# EAGLE board TSC_Project (EAGLE 9.7.0)
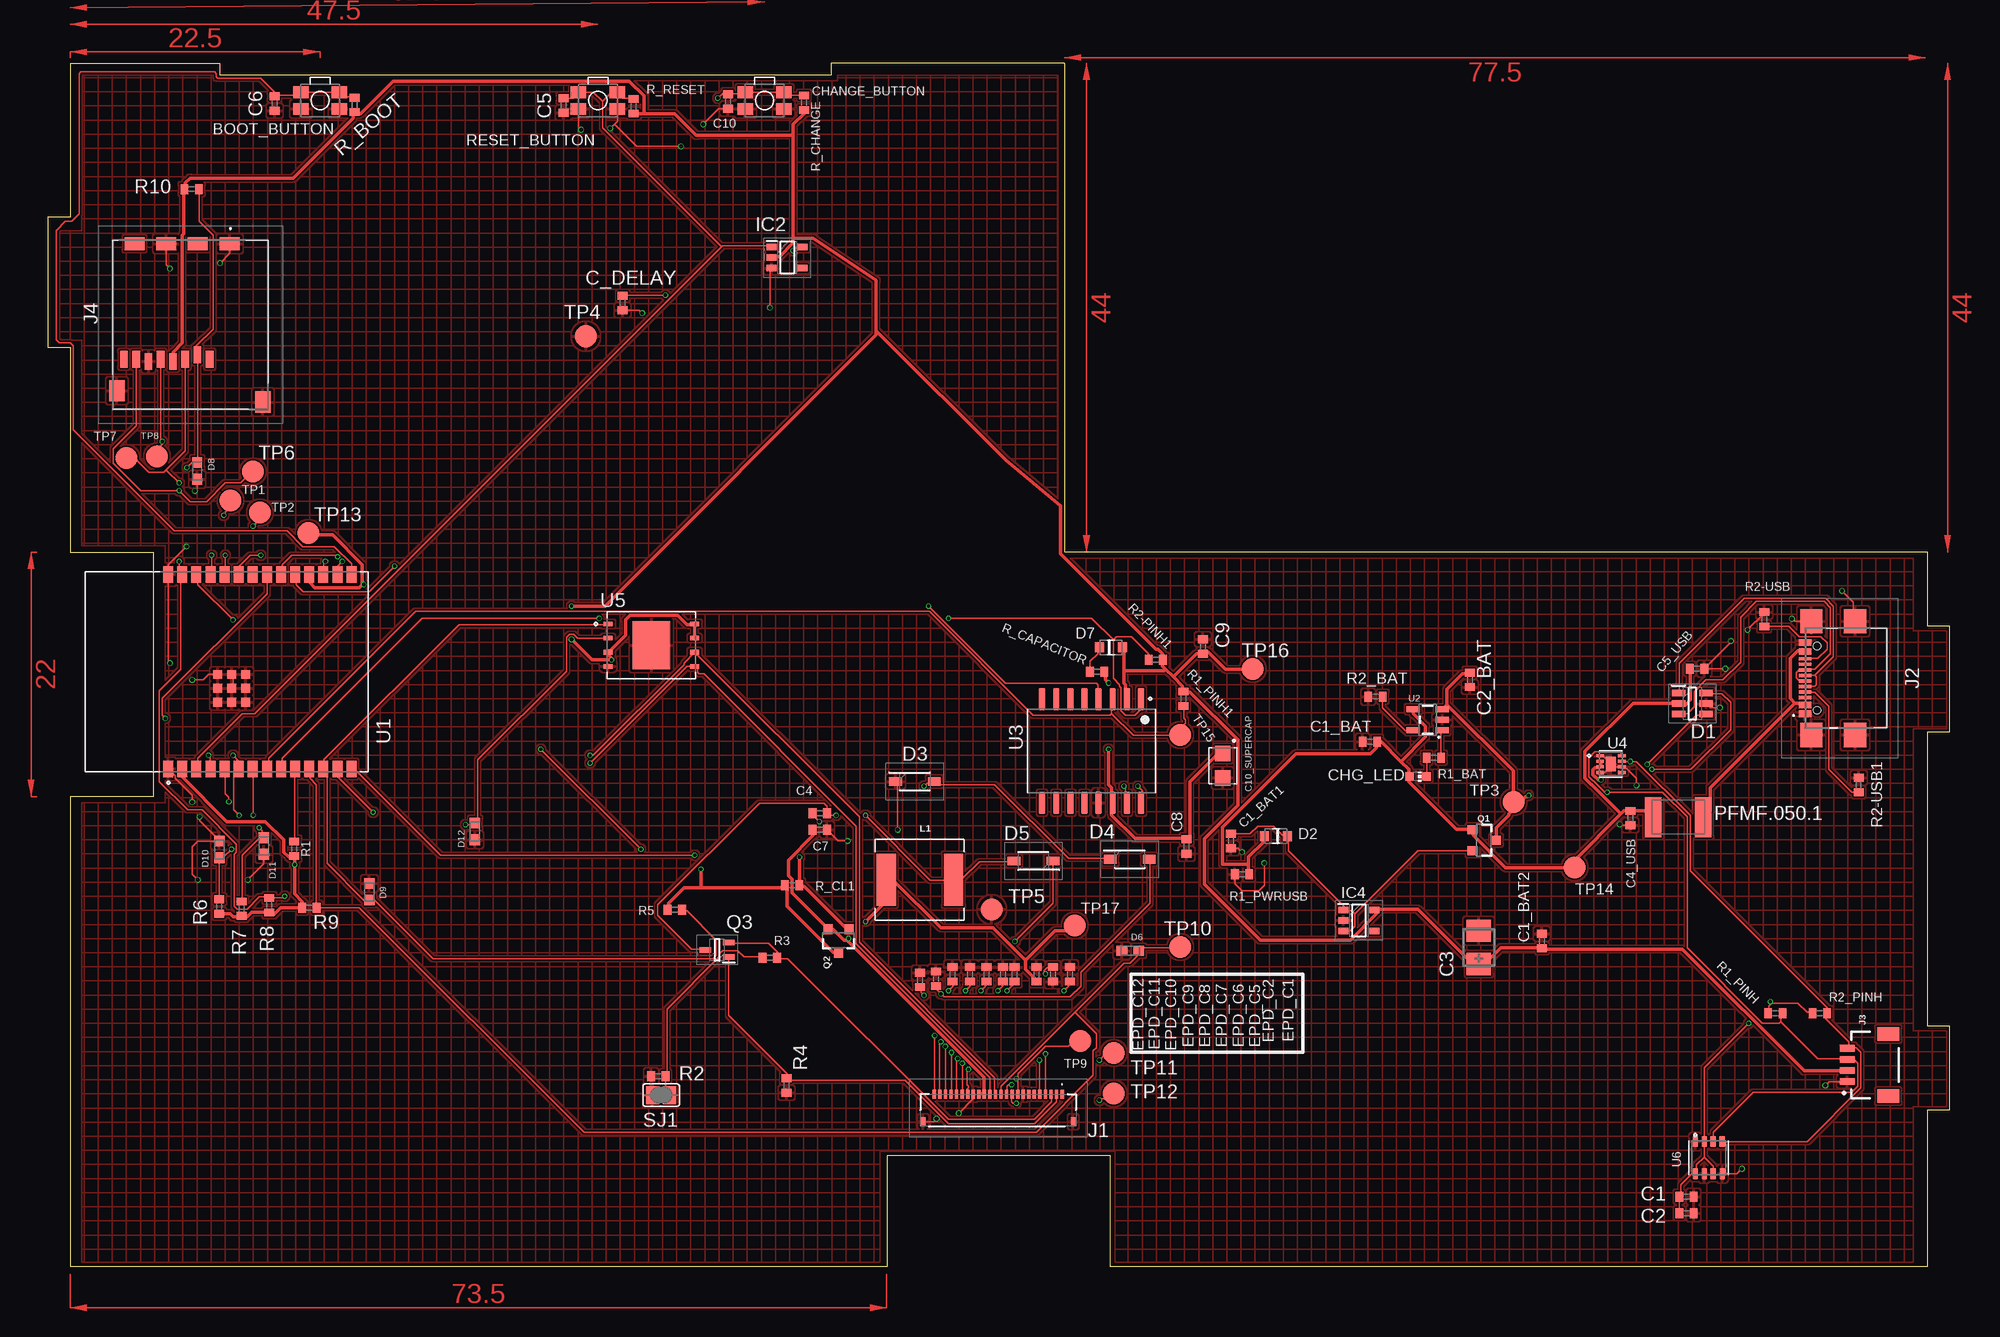
[diagram p1: board, top side]
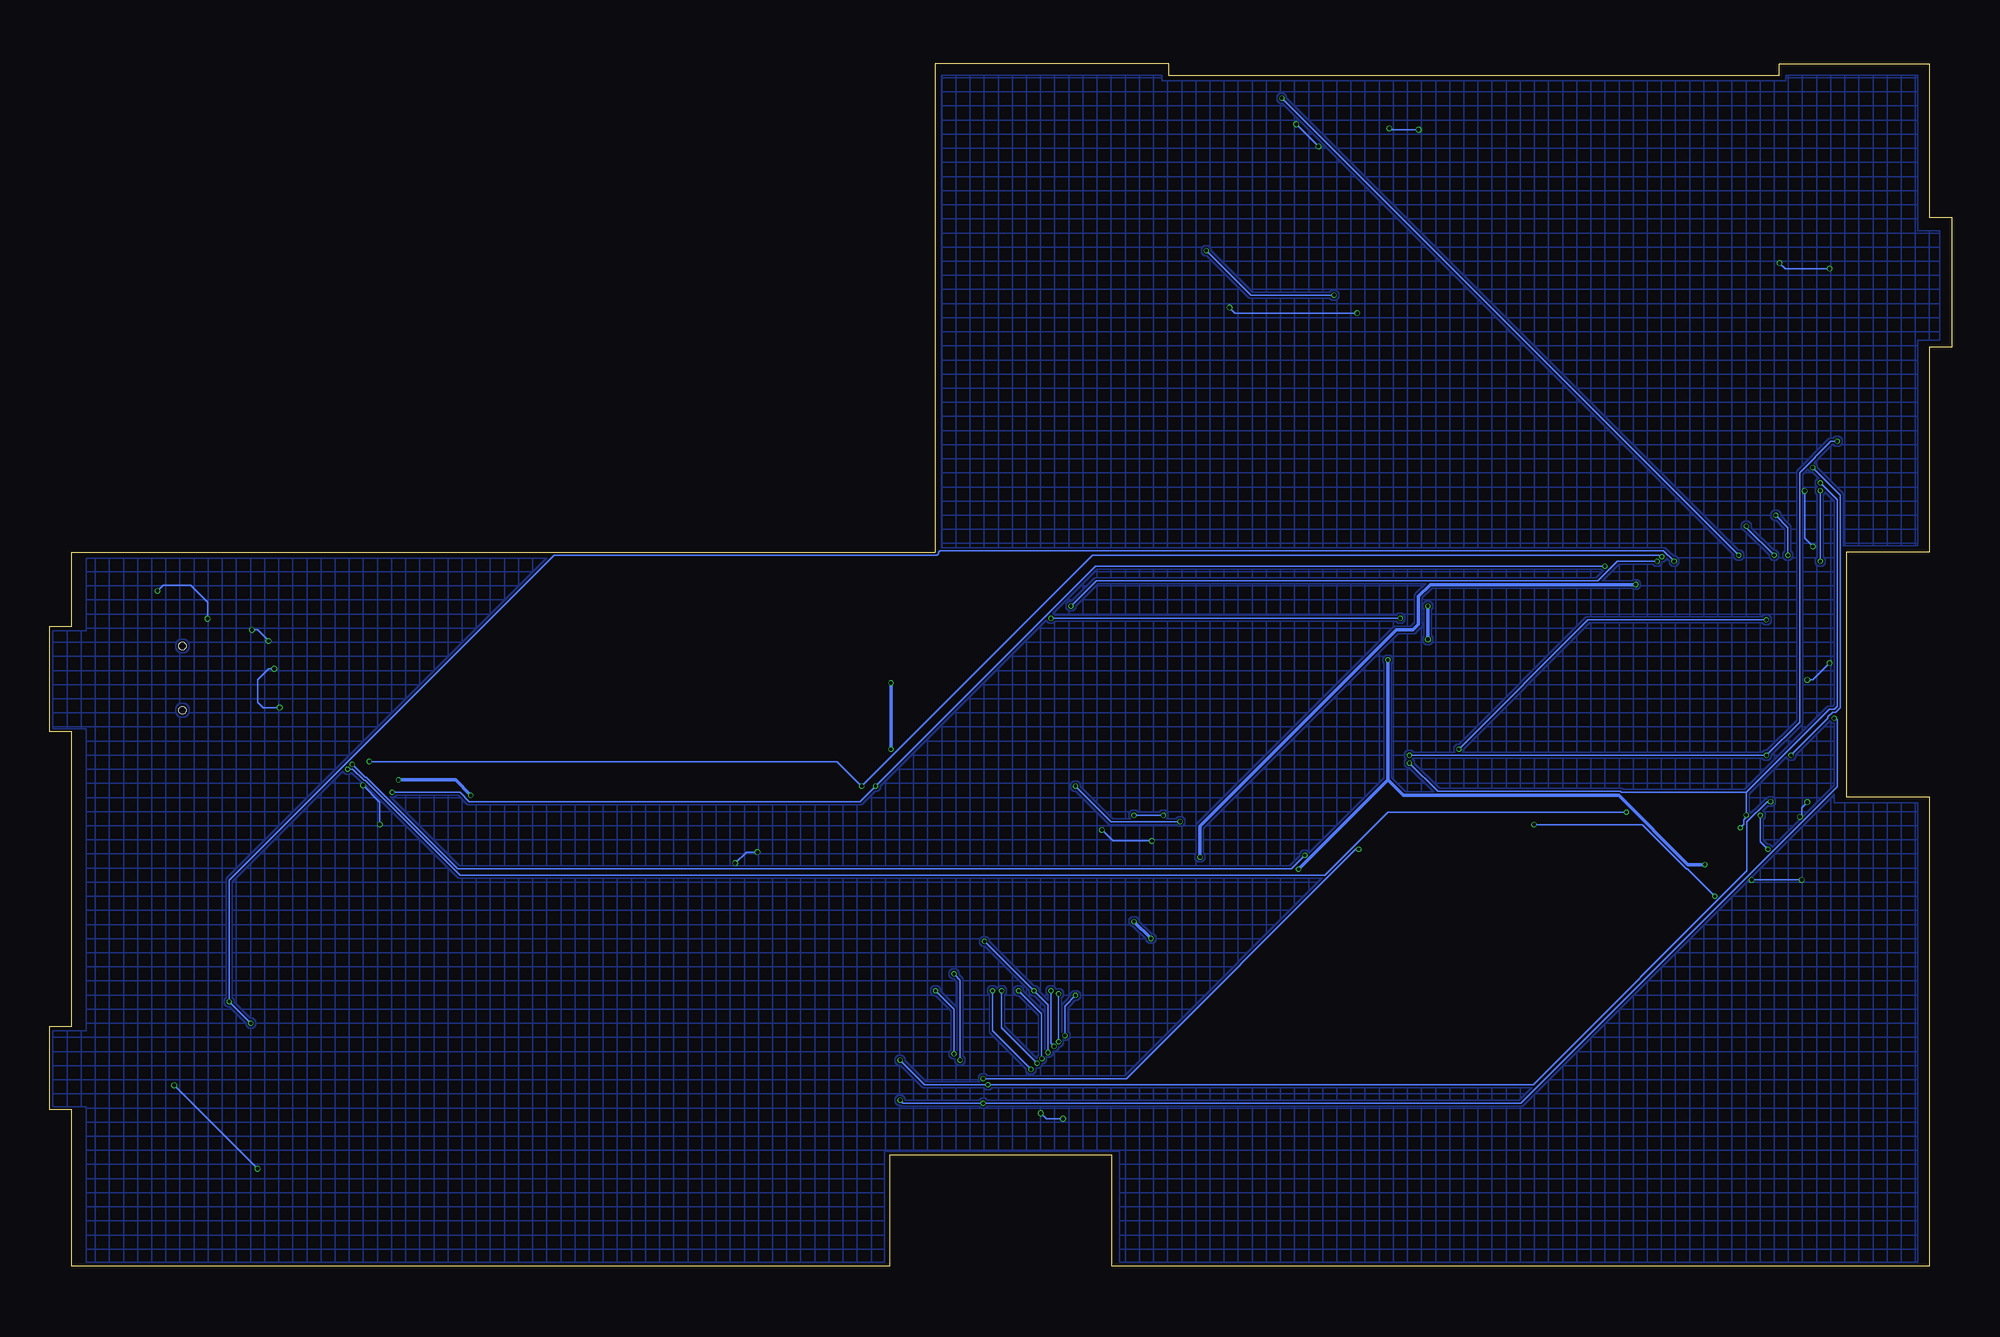
[diagram p2: board, bottom side, seen from below]

Size 171.2 x 108.28 mm. Coordinates in mm from the lower left corner, seen from the top.
Outline: 95.6,10 95.6,0 169.2,0 169.2,14.1 171.2,14.1 171.2,21.63 169.2,21.63 169.2,48.1 171.2,48.1 171.2,57.6 169.2,57.6 169.2,64.28 91.5,64.28 91.5,108.28 70.5,108.28 70.5,107.2 15.5,107.2 15.5,108.2 2,108.2 2,94.4 0,94.4 0,82.7 2,82.7 2,64.28 9.5,64.28 9.5,42.28 2,42.28 2,0 75.6,0 75.6,10 95.6,10
Copper layers (1*16): Top 0.035mm / dielectric 1.6mm / Bottom 0.035mm
Design rules "jlcpcb-2layers.dru": minimum track width 0.15mm, minimum drill 0.3mm, track to track 5mil, track to pad 5mil, pad to pad 5mil, via to via 5mil, smd to smd 5mil, copper to edge 0.2mm, drill to drill 6mil, minimum pad ring 10mil, minimum via ring 3mil, stop-mask expansion 4mil, vias tented up to drill 0mil, thermal gap 10mil

## Footprints (pad centres in the part's own frame; a part is rotated, then mirrored left to right if it is on the bottom)
MYBUTTON = smd 1.4 x 1.05: 1 1.75,0.75; 2 -1.75,0.75; 3 -1.75,-0.75; 4 1.75,-0.75
ESP32_WROVER_EAGLE-LTSPICE_C0402 = smd 0.7 x 0.9: 1 -0.65,0; 2 0.65,0
EAGLE-LTSPICE_C0402 = smd 0.7 x 0.9: 1 -0.65,0; 2 0.65,0
RCL_CT3528 = smd 2 x 2.2: + -1.5,0; - 1.5,0
CAPCP3225X100N = smd 1.4 x 1.4: 1 -1.1,0; 2 1.1,0
ADAFRUIT_CHIP-LED0603 = smd 0.8 x 0.8: A 0,-0.75; C 0,0.75
SOT95P280X145-6N = smd 1.2 x 0.6: 1 -1.25,0.95; 2 -1.25,0; 3 -1.25,-0.95; 4 1.25,-0.95; 5 1.25,0; 6 1.25,0.95
ESP32_WROVER_AVX---SD0805S020S1R0_AVX_SD0805S020S1R0_0 = smd 0.8 x 0.9: 1 -1.05,0; 2 1.05,0
SOD3716X135N = smd 1.15 x 0.8: 1 -1.75,0; 2 1.75,0
DIOC1608X36N = smd 0.97 x 0.94: 1 -0.75,0; 2 0.75,0
SOT95P280X125-5N = smd 0.9 x 0.6: 1 -1.4,0.95; 2 -1.4,0; 3 -1.4,-0.95; 4 1.4,-0.95; 5 1.4,0.95
SOT95P280X120-5N = smd 0.9 x 0.6: 1 -1.4,0.95; 2 -1.4,0; 3 -1.4,-0.95; 4 1.4,-0.95; 5 1.4,0.95
FH34SRJ24S05SH99 = smd 0.3 x 0.8: 1 5.75,1.45; 2 5.25,1.45; 3 4.75,1.45; 4 4.25,1.45; 5 3.75,1.45; 6 3.25,1.45; 7 2.75,1.45; 8 2.25,1.45; 9 1.75,1.45; 10 1.25,1.45; 11 0.75,1.45; 12 0.25,1.45; 13 -0.25,1.45; 14 -0.75,1.45; 15 -1.25,1.45; 16 -1.75,1.45; 17 -2.25,1.45; 18 -2.75,1.45; 19 -3.25,1.45; 20 -3.75,1.45; 21 -4.25,1.45; 22 -4.75,1.45; 23 -5.25,1.45; 24 -5.75,1.45 | smd 0.4 x 0.8: MP1 6.75,-1.05; MP2 -6.75,-1.05
SAMACSYS_PARTS_USB4110GFA = smd 0.3 x 1.15: A1 -3.35,3.678; A4 -2.55,3.678; A5 -1.25,3.678; A6 -0.25,3.678; A7 0.25,3.678; A8 1.25,3.678; A9 2.55,3.678; A12 3.35,3.678; B1 3.05,3.678; B4 2.25,3.678; B5 1.75,3.678; B6 0.75,3.678; B7 -0.75,3.678; B8 -1.75,3.678; B9 -2.25,3.678; B12 -3.05,3.678 | smd 2.18 x 2: MP1 -5.11,-0.827; MP2 5.11,-0.827; MP3 -5.11,3.103; MP4 5.11,3.103 | hole 0.65: -2.89,2.603; 2.89,2.603
JST04_1MM_RA = smd 0.6 x 1.35: 1 -1.5,0; 2 -0.5,0; 3 0.5,0; 4 1.5,0 | smd 1.2 x 2: NC1 2.8,-3.675; NC2 -2.8,-3.675
112ATAARR03ATTEND = smd 1.8 x 1.2: G1 10.6,10.4; G2 4.9,10.4; S1 7.75,10.4; S2 2.05,10.4 | smd 1.4 x 1.9: G3 13.6,-3.85; G4 0.45,-2.85 | smd 0.7 x 1.5: P1 8.8,0; P2 7.7,0.4; P3 6.6,0; P4 5.5,-0.2; P5 4.4,0; P6 3.3,-0.2; P7 2.2,0; P8 1.1,0
CR75 = smd 1.75 x 4.7: P$1 -3.025,0; P$2 3.025,0
ESP32C6_VARISTOR_CT/CN1812 = smd 1.5 x 3.6: 1 -2.25,0; 2 2.25,0
ESP32_WROVER_SPARKFUN-DISCRETESEMI_SOT23-3 = smd 0.8 x 0.9: 1 -0.95,-1; 2 0.95,-1; 3 0,1.1
SOT65P210X110-3N = smd 1.05 x 0.5: 1 -1.05,0.65; 2 -1.05,-0.65; 3 1.05,0
ESP32_WROVER_EAGLE-LTSPICE_R0402 = smd 0.7 x 0.9: 1 -0.65,0; 2 0.65,0
SJ = smd 1.168 x 1.6: 1 -0.762,0; 2 0.762,0
TP20R = smd 2 x 2: TP 0,0
XCVR_ESP32-C6-WROOM-1-N8 = smd 1.5 x 0.9: 1 -8.75,5.26; 2 -8.75,3.99; 3 -8.75,2.72; 4 -8.75,1.45; 5 -8.75,0.18; 6 -8.75,-1.09; 7 -8.75,-2.36; 8 -8.75,-3.63; 9 -8.75,-4.9; 10 -8.75,-6.17; 11 -8.75,-7.44; 12 -8.75,-8.71; 13 -8.75,-9.98; 14 -8.75,-11.25; 15 8.75,-11.25; 16 8.75,-9.98; 17 8.75,-8.71; 18 8.75,-7.44; 19 8.75,-6.17; 20 8.75,-4.9; 21 8.75,-3.63; 22 8.75,-2.36; 23 8.75,-1.09; 24 8.75,0.18; 25 8.75,1.45; 26 8.75,2.72; 27 8.75,3.99; 28 8.75,5.26 | smd 0.8 x 0.8: 29_1 -2.755,0.79; 29_2 -1.505,0.79; 29_3 -0.255,0.79; 29_4 -2.755,-0.46; 29_5 -1.505,-0.46; 29_6 -0.255,-0.46; 29_7 -2.755,-1.71; 29_8 -1.505,-1.71; 29_9 -0.255,-1.71
ESP32_WROVER_SPARKFUN-IC-POWER_SOT23-5 = smd 0.55 x 1.2: 1 -0.95,-1.3; 2 0,-1.3; 3 0.95,-1.3; 4 0.95,1.3; 5 -0.95,1.3
SOIC127P1032X265-16N = smd 2.05 x 0.59: 1 -4.655,4.445; 2 -4.655,3.175; 3 -4.655,1.905; 4 -4.655,0.635; 5 -4.655,-0.635; 6 -4.655,-1.905; 7 -4.655,-3.175; 8 -4.655,-4.445; 9 4.655,-4.445; 10 4.655,-3.175; 11 4.655,-1.905; 12 4.655,-0.635; 13 4.655,0.635; 14 4.655,1.905; 15 4.655,3.175; 16 4.655,4.445
SON50P200X200X80-9N = smd 0.76 x 0.27: 1 -0.985,0.75; 2 -0.985,0.25; 3 -0.985,-0.25; 4 -0.985,-0.75; 5 0.985,-0.75; 6 0.985,-0.25; 7 0.985,0.25; 8 0.985,0.75 | smd 0.9 x 1.3: 9 0,0
SON127P600X800X80-9N = smd 0.94 x 0.44: 1 -3.895,1.905; 2 -3.895,0.635; 3 -3.895,-0.635; 4 -3.895,-1.905; 5 3.895,-1.905; 6 3.895,-0.635; 7 3.895,0.635; 8 3.895,1.905 | smd 3.4 x 4.3: 9 0,0
ESP32_WROVER_BME680_PSON80P300X300X100-8N = smd 1.016 x 0.5: 1 1.458,1.2; 2 1.458,0.4; 3 1.458,-0.4; 4 1.458,-1.2; 5 -1.458,-1.22; 6 -1.458,-0.4; 7 -1.458,0.4; 8 -1.458,1.2

## Placement (x,y rotation side)
BOOT_BUTTON  BUTTON_CUSYOMV1  [MYBUTTON]  24.52,104.91 180 top
C1  100nF  [ESP32_WROVER_EAGLE-LTSPICE_C0402]  147.5,6.28 0 top
C1_BAT  4.7uF  [ESP32_WROVER_EAGLE-LTSPICE_C0402]  119,47.23 180 top
C1_BAT1  4.7uF  [EAGLE-LTSPICE_C0402]  106.5,38.28 270 top
C1_BAT2  4.7uF  [EAGLE-LTSPICE_C0402]  134.5,29.28 90 top
C2  100nF  [ESP32_WROVER_EAGLE-LTSPICE_C0402]  147.5,4.78 0 top
C2_BAT  4.7uF  [ESP32_WROVER_EAGLE-LTSPICE_C0402]  128,52.78 270 top
C3  100uF TANT  [RCL_CT3528]  128.81,28.7 90 top
C4  4.7uF/25V  [ESP32_WROVER_EAGLE-LTSPICE_C0402]  69.5,40.78 0 top
C4_USB  100nF  [EAGLE-LTSPICE_C0402]  142.45,40.33 270 top
C5  1uF  [ESP32_WROVER_EAGLE-LTSPICE_C0402]  46.42,104.46 270 top
C5_USB  4.7uF  [EAGLE-LTSPICE_C0402]  148.45,53.76 0 top
C6  100nF  [ESP32_WROVER_EAGLE-LTSPICE_C0402]  20.42,104.64 270 top
C7  10uF  [ESP32_WROVER_EAGLE-LTSPICE_C0402]  69.5,39.28 0 top
C8  100nF  [ESP32_WROVER_EAGLE-LTSPICE_C0402]  102.5,37.78 270 top
C9  100nF  [ESP32_WROVER_EAGLE-LTSPICE_C0402]  104,55.78 90 top
C10  100nF  [ESP32_WROVER_EAGLE-LTSPICE_C0402]  61.25,104.83 270 top
C10_SUPERCAP  CPH3225A  [CAPCP3225X100N]  105.77,45.05 270 top
C_DELAY  100nF  [EAGLE-LTSPICE_C0402]  51.75,86.7 270 top
CHANGE_BUTTON  BUTTON_CUSYOMV1  [MYBUTTON]  64.52,104.91 180 top
CHG_LED  [ADAFRUIT_CHIP-LED0603]  123.33,44.08 270 top
D1  USBLC6-2SC6Y  [SOT95P280X145-6N]  148.03,50.65 0 top
D2  ESP32_WROVER_AVX---SD0805S020S1R0_AVX_SD0805S020S1R0_0_0AVX_SD0805S020S1R0_0_0  [ESP32_WROVER_AVX---SD0805S020S1R0_AVX_SD0805S020S1R0_0]  110.55,38.71 180 top
D3  MBR0530  [SOD3716X135N]  78.05,43.63 0 top
D4  MBR0530  [SOD3716X135N]  97.39,36.63 0 top
D5  MBR0530  [SOD3716X135N]  88.72,36.48 180 top
D6  PGB1010603MR  [DIOC1608X36N]  97.45,28.4 0 top
D7  ESP32_WROVER_AVX---SD0805S020S1R0_AVX_SD0805S020S1R0_0_0AVX_SD0805S020S1R0_0_0  [ESP32_WROVER_AVX---SD0805S020S1R0_AVX_SD0805S020S1R0_0]  95.7,55.71 0 top
D8  PGB1010603MR  [DIOC1608X36N]  13.45,71.59 90 top
D9  PGB1010603MR  [DIOC1608X36N]  28.95,33.71 270 top
D10  PGB1010603MR  [DIOC1608X36N]  15.45,37.52 270 top
D11  PGB1010603MR  [DIOC1608X36N]  19.45,37.83 90 top
D12  PGB1010603MR  [DIOC1608X36N]  38.45,39.14 90 top
EPD_C1  1uF/50V  [ESP32_WROVER_EAGLE-LTSPICE_C0402]  92,26.28 270 top
EPD_C2  1uF/50V  [ESP32_WROVER_EAGLE-LTSPICE_C0402]  90.5,26.28 90 top
EPD_C5  1uF/50V  [ESP32_WROVER_EAGLE-LTSPICE_C0402]  89,26.28 270 top
EPD_C6  1uF/50V  [ESP32_WROVER_EAGLE-LTSPICE_C0402]  87.03,26.28 270 top
EPD_C7  1uF/50V  [ESP32_WROVER_EAGLE-LTSPICE_C0402]  86,26.28 270 top
EPD_C8  1uF/50V  [ESP32_WROVER_EAGLE-LTSPICE_C0402]  84.5,26.28 270 top
EPD_C9  1uF/50V  [ESP32_WROVER_EAGLE-LTSPICE_C0402]  83,26.28 270 top
EPD_C10  1uF/50V  [ESP32_WROVER_EAGLE-LTSPICE_C0402]  81.45,26.28 270 top
EPD_C11  1uF/50V  [ESP32_WROVER_EAGLE-LTSPICE_C0402]  79.95,25.88 270 top
EPD_C12  1uF/50V  [ESP32_WROVER_EAGLE-LTSPICE_C0402]  78.5,25.78 270 top
IC2  BD5229G-TR  [SOT95P280X125-5N]  66.56,90.78 0 top
IC4  XC6220A331MR-G  [SOT95P280X120-5N]  118.02,31.13 0 top
J1  FH34SRJ-24S-0.5SH_99_  [FH34SRJ24S05SH99]  85.55,14.05 0 top
J2  SAMACSYS_PARTS_USB4110-GF-A  [SAMACSYS_PARTS_USB4110GFA]  161.85,52.93 90 top
J3  QWIIC_RIGHT_ANGLE  [JST04_1MM_RA]  161.99,18.12 90 top
J4  112A-TAAR-R03_ATTEND  [112ATAARR03ATTEND]  5.77,81.63 0 top
L1  68uH  [CR75]  78.5,34.78 0 top
PFMF.050.1  ESP32C6_VARISTORCN1812  [ESP32C6_VARISTOR_CT/CN1812]  146.76,40.43 180 top
Q1  20V/4.2A/52mΩ/1.4W  [ESP32_WROVER_SPARKFUN-DISCRETESEMI_SOT23-3]  129.25,38.34 270 top
Q2  20V/4.2A/52mΩ/1.4W  [ESP32_WROVER_SPARKFUN-DISCRETESEMI_SOT23-3]  71.17,29.34 180 top
Q3  SI1308EDL-T1-GE3  [SOT65P210X110-3N]  60.25,28.48 180 top
R1  10K  [ESP32_WROVER_EAGLE-LTSPICE_R0402]  22.18,37.58 270 top
R1_BAT  200  [ESP32_WROVER_EAGLE-LTSPICE_R0402]  124.76,45.78 0 top
R1_PINH  10K  [ESP32_WROVER_EAGLE-LTSPICE_R0402]  155.5,22.78 180 top
R1_PINH1  10K  [ESP32_WROVER_EAGLE-LTSPICE_R0402]  102.21,51.08 90 top
R1_PWRUSB  100K  [ESP32_WROVER_EAGLE-LTSPICE_R0402]  107.5,35.28 0 top
R2  2.2  [ESP32_WROVER_EAGLE-LTSPICE_R0402]  54.95,17.1 0 top
R2-PINH1  10K  [ESP32_WROVER_EAGLE-LTSPICE_R0402]  99.74,54.58 0 top
R2-USB  5k1  [ESP32_WROVER_EAGLE-LTSPICE_R0402]  154.49,58.23 90 top
R2-USB1  5k1  [ESP32_WROVER_EAGLE-LTSPICE_R0402]  162.99,43.31 270 top
R2_BAT  2K  [ESP32_WROVER_EAGLE-LTSPICE_R0402]  119.5,51.28 0 top
R2_PINH  10K  [ESP32_WROVER_EAGLE-LTSPICE_R0402]  159.5,22.78 180 top
R3  0.47  [ESP32_WROVER_EAGLE-LTSPICE_R0402]  65,27.78 0 top
R4  10K  [ESP32_WROVER_EAGLE-LTSPICE_R0402]  66.5,16.28 90 top
R5  10K  [ESP32_WROVER_EAGLE-LTSPICE_R0402]  56.45,32.07 180 top
R6  10K  [ESP32_WROVER_EAGLE-LTSPICE_R0402]  15.45,32.38 270 top
R7  10K  [ESP32_WROVER_EAGLE-LTSPICE_R0402]  17.45,32.19 270 top
R8  10K  [ESP32_WROVER_EAGLE-LTSPICE_R0402]  19.95,32.5 270 top
R9  10K  [ESP32_WROVER_EAGLE-LTSPICE_R0402]  23.55,32.26 180 top
R10  10K  [ESP32_WROVER_EAGLE-LTSPICE_R0402]  12.95,96.95 180 top
R_BOOT  10K  [ESP32_WROVER_EAGLE-LTSPICE_R0402]  27.62,104.52 270 top
R_CAPACITOR  15  [ESP32_WROVER_EAGLE-LTSPICE_R0402]  94.45,53.52 0 top
R_CHANGE  10K  [ESP32_WROVER_EAGLE-LTSPICE_R0402]  68.07,104.71 270 top
R_CL1  10K  [ESP32_WROVER_EAGLE-LTSPICE_R0402]  67,34.28 180 top
R_RESET  10K  [ESP32_WROVER_EAGLE-LTSPICE_R0402]  52.75,104.39 270 top
RESET_BUTTON  BUTTON_CUSYOMV1  [MYBUTTON]  49.52,104.91 180 top
SJ1  [SJ]  55.22,15.41 0 top
TP1  TPTP20R  [TP20R]  16.45,68.94 0 top
TP2  TPTP20R  [TP20R]  19.1,67.86 0 top
TP3  TPTP20R  [TP20R]  131.95,41.78 0 top
TP4  TPTP20R  [TP20R]  48.45,83.7 0 top
TP5  TPTP20R  [TP20R]  84.95,32.12 0 top
TP6  TPTP20R  [TP20R]  18.45,71.54 0 top
TP7  TPTP20R  [TP20R]  7.1,72.75 0 top
TP8  TPTP20R  [TP20R]  9.83,72.88 0 top
TP9  TPTP20R  [TP20R]  92.95,20.3 0 top
TP10  TPTP20R  [TP20R]  101.95,28.72 0 top
TP11  TPTP20R  [TP20R]  95.95,19.21 0 top
TP12  TPTP20R  [TP20R]  95.95,15.56 0 top
TP13  TPTP20R  [TP20R]  23.45,65.98 0 top
TP14  TPTP20R  [TP20R]  137.45,35.9 0 top
TP15  TPTP20R  [TP20R]  101.95,47.82 0 top
TP16  TPTP20R  [TP20R]  108.45,53.74 0 top
TP17  TPTP20R  [TP20R]  92.45,30.66 0 top
U1  ESP32-C6-WROOM-1-N8  [XCVR_ESP32-C6-WROOM-1-N8]  16.1,53.52 90 top
U2  ESP32_WROVER_SPARKFUN-IC-POWER_MCP73831  [ESP32_WROVER_SPARKFUN-IC-POWER_SOT23-5]  124.21,49.2 90 top
U3  DS3231SN#  [SOIC127P1032X265-16N]  93.95,46.38 270 top
U4  MAX17048G+T10  [SON50P200X200X80-9N]  140.7,45.2 0 top
U5  W25Q512JVEIQ  [SON127P600X800X80-9N]  54.33,55.9 0 top
U6  ESP32_WROVER_BME680_BME680  [ESP32_WROVER_BME680_PSON80P300X300X100-8N]  149.5,9.78 90 top

## Tracks (layer width: path | path; a pad name or v marks a point on that pad's centre or on a via)
3V3  (via drill 0.3, 0.35)
  Top 0.3: R6.2 15.57,31.72 16.4,31.72 16.68,31.44 17.37,31.44 R7.2 17.51,31.44 17.93,31.44 18.34,31.86 19.87,31.86 R8.2 20,31.72 20.42,31.72 20.97,32.27 22.77,32.27 R9.2 22.91,32.27 22.91,32.83 22.22,33.52 v22.22,36.15 22.22,36.84 R1.2 22.08,36.84 21.67,36.84 21.25,37.26 21.25,38.37 19.59,40.03 16.13,40.03 12.11,44.05 12.11,44.74 U1.2 | U5.7 58.23,56.65 58.23,57.76 U5.8 58.09,57.76 57.54,57.76 56.71,58.59 52.41,58.59 52,58.17 52,56.79 50.61,55.4 50.48,55.4 U5.3 50.48,55.26 50.48,54.99 50.75,54.71 v50.75,54.57 49,54.57 v47.15,56.42 | 58.78,34.07 66.13,34.07 66.26,34.21 R_CL1.2 66.4,34.21 66.54,34.07 66.54,32.41 70.7,28.26 71.11,28.26 Q2.3 | 58.78,34.07 57.26,34.07 55.88,32.69 55.88,32.13 R5.2 | 58.78,34.07 v58.78,35.74 | 67.09,101.77 67.09,102.77 68.06,103.74 68.06,104.02 R_CHANGE.2 | 67.09,101.77 67.09,92.52 | 67.09,92.52 67.09,92.11 65.85,90.86 65.29,90.86 IC2.2 | 53.66,103.74 52.83,103.74 R_RESET.2 | J4.P4 11.28,81.44 11.28,82.27 12.11,83.1 12.11,92.8 12.25,92.94 12.25,96.81 R10.2 12.39,96.95 12.39,97.51 12.8,97.92 22.08,97.92 27.48,103.32 27.48,103.74 R_BOOT.2 27.62,103.74 28.18,103.74 31.09,106.65 52.33,106.65 53.66,105.32 53.66,103.74 | 96.87,53.6 96.87,52.5 97.01,52.36 97.01,51.11 U3.2 | 96.87,53.6 96.87,55.68 D7.2 | 100.61,53.74 100.33,54.02 100.33,54.57 R2-PINH1.2 100.33,54.71 100.33,55.13 99.92,55.54 99.74,55.54 91.15,64.13 91.15,68.43 86.25,72.53 74.57,84.21 | 100.61,53.74 101.31,53.05 | 101.31,53.05 102.14,52.22 102.14,51.8 R1_PINH1.2 102.27,51.66 102.83,51.66 107.12,47.37 107.12,41.5 104.11,38.48 104.11,34.4 109.14,29.37 117.23,29.37 119.59,31.72 119.59,32.13
  Top 0.3: 101.31,53.05 103.38,55.13 103.94,55.13 C9.1 104.08,55.26 104.49,55.26 106.01,53.74 108.37,53.74 TP16.TP | 96.87,53.6 100.47,53.6 100.61,53.74 | 119.59,32.13 123.33,32.13 128.17,27.29 128.73,27.29 C3.+ 128.87,27.29 129.42,27.29 130.81,28.67 134.41,28.67 C1_BAT2.1 134.54,28.53 147.15,28.53 158.09,17.59 161.97,17.59 J3.2 | 119.59,32.13 119.45,32.13 IC4.5 119.59,32.13 | 67.09,92.52 68.89,92.52 74.5,88.78 74.57,88.71 74.57,84.21 | 74.57,84.21 74.57,83.84 50.15,59.42 v47.15,59.42 | 53.66,103.74 56.4,103.74 58.37,101.77 67.09,101.77
  Bottom 0.3: 50.75,43.77 v50.75,54.57 | 50.75,43.77 v58.78,35.74 | v22.22,36.15 23.74,36.15 29.98,42.38 49.37,42.38 50.75,43.77 | v47.15,56.42 v47.15,59.42
32KHZ  (via drill 0.3)
  Top 0.15: 95.9,56.37 96.18,56.65 97.56,56.65 99.09,55.13 99.09,54.71 R2-PINH1.1 | 95.9,56.37 95.9,52.91 96.46,52.36 96.46,52.22 96.6,52.08 96.6,50 97.01,49.59 97.84,49.59 98.26,50 98.26,50.97 U3.1 | v49.64,58.31 33.72,58.31 21.11,45.71 21.11,44.88 U1.9 | v81.08,58.31 93.96,58.31 95.9,56.37
  Bottom 0.15: v81.08,58.31 v49.64,58.31
DN
  Top 0.15: 159.06,53.19 159.2,53.05 159.2,52.36 159.06,52.22 158.23,52.22 J2.B7 | 159.06,53.19 158.23,53.19 J2.A7 | 159.06,53.19 160.72,54.85 160.72,59.42 160.03,60.11 152.69,60.11 146.87,54.3 146.87,51.66 D1.1
DP
  Top 0.15: J2.A6 158.09,52.63 157.71,52.63 157.4,52.95 157.4,53.41 157.72,53.74 158.09,53.74 J2.B6 158.23,53.74 159.06,53.74 160.44,55.13 160.44,59.28 159.89,59.84 153.8,59.84 152.38,58.42 152.38,54.37 150.78,52.77 149.27,52.77 148.19,51.7 148.19,50.35 147.56,49.72 146.87,49.72 D1.3
EPD_3V3  (via drill 0.3)
  Top 0.3: 88.01,27.57 90.64,30.2 92.03,30.2 92.44,30.61 TP17.TP | 88.01,27.57 85.1,30.47 80.39,30.47 76.1,34.77 75.54,34.77 L1.P$1 75.41,34.77 75.41,32.83 v73.61,31.03 | 84.27,15.51 83.85,15.51 J1.16 | 84.27,15.51 84.27,17.04 71.94,29.37 | 71.94,29.37 71.67,29.37 70.7,30.34 70.28,30.34 Q2.2 70.22,30.39 66.98,33.64 66.98,34.84 66.68,35.14 66.68,36.57 68.89,38.78 68.85,38.83 C7.1 | 84.27,15.51 J1.15 | 71.94,29.37 v72.08,29.5 | EPD_C5.2 89,25.74 88.01,26.73 88.01,27.57
  Bottom 0.3: v72.08,29.5 v73.61,31.03
EPD_3V3_C  (via drill 0.3)
  Top 0.3: Q2.1 72.08,30.47 71.8,30.47 68.06,34.21 67.79,34.21 R_CL1.1 v67.65,36.83 v67.66,36.83 | 28.32,61.36 28.04,61.08 24.02,61.08 23.61,61.5 23.61,62.19 U1.18 | 28.32,61.36 28.32,63.16 25.64,65.84 23.56,65.84 23.47,65.93 TP13.TP | 28.32,61.36 v28.45,61.36
  Bottom 0.3: v28.45,61.36 46.92,61.36 48,60.28 48,57.78 48.5,57.28 49.98,57.28 67.65,39.61 67.65,36.84 v67.66,36.83
EPD_BUSY  (via drill 0.3)
  Top 0.15: 87.32,16.9 87.32,17.32 89.81,19.81 91.89,19.81 92.16,20.09 92.72,20.09 92.86,20.22 TP9.TP | 87.32,16.9 87.32,15.51 J1.9 | v16.68,58.17 13.49,61.36 13.49,62.19 U1.26 | v53.38,37.54 v44.38,46.54 | 87.32,16.9 v87.18,16.9
  Bottom 0.15: v16.68,58.17 32.75,58.17 v44.38,46.54 | v53.38,37.54 53.66,37.54 74.3,16.9 v87.18,16.9
EPD_CS
  Top 0.15: U1.11 23.61,44.74 23.61,43.91 24.16,43.35 24.16,32.27 R9.1 24.3,32.27 28.04,32.27 48.26,12.05 88.98,12.05 94.1,17.18 94.1,19.39 94.38,19.67 94.38,20.92 92.44,22.86 | 92.44,22.86 96.87,27.29 97.43,27.29 98.12,27.98 98.12,28.4 D6.2 98.26,28.53 98.4,28.67 101.86,28.67 TP10.TP | 92.44,22.86 85.79,16.21 85.79,15.51 J1.12
EPD_DC  (via drill 0.3)
  Top 0.15: v86.76,16.35 86.48,16.35 86.35,16.21 86.35,15.51 J1.11 | v94.66,18.56 95.21,19.12 95.9,19.12 TP11.TP | U1.5 15.99,44.74 15.99,42.52 16.31,42.2 v16.31,41.83
  Bottom 0.15: v94.66,18.56 92.44,16.35 v86.76,16.35 37.68,16.35 18.43,35.6 18.43,40 16.59,41.83 v16.31,41.83
EPD_RST  (via drill 0.3)
  Top 0.15: v87.18,14.68 86.9,14.68 86.76,14.82 86.76,15.38 J1.10 | v94.66,14.96 94.8,15.1 95.49,15.1 95.9,15.51 TP12.TP | v10.59,49.31 10.31,49.59 10.31,51.11 19.73,60.53 19.73,62.19 U1.21
  Bottom 0.15: v94.66,14.96 94.38,14.68 v87.18,14.68 38.79,14.68 10.31,43.16 10.31,49.17 10.45,49.31 v10.59,49.31
FLASH_CS
  Top 0.15: R5.1 57.12,32 57.54,32 60.17,29.37 60.17,27.98 59.89,27.7 34.69,27.7 29.42,32.97 29.01,32.97 D9.2 28.87,32.97 28.45,32.97 25.13,36.29 25.13,44.46 24.85,44.74 U1.12 24.85,44.88 24.85,45.57 37.04,57.76 50.34,57.76 U5.1
GDR
  Top 0.15: J1.2 90.78,15.38 90.78,14.82 88.81,12.85 81.07,12.85 77.16,16.76 66.68,16.76 66.54,16.9 R4.2 66.54,17.04 66.54,17.32 61.28,22.58 61.28,27.7 Q3.1
GND  (via drill 0.35)
  Top 0.15: U1.29_5 16.68,52.08 16.68,53.19 U1.29_6 | C7.2 71.15,38.28 v72,38.28 | v76.5,39.28 76.5,43.43 D3.1 | J1.17 83.3,15.08 v82,13.78 | v80,13.28 79.72,13 J1.MP2 | U4.1 140,45.95 140.3,45.65 140.3,45.6 U4.9 140.81,45.09 | 140.81,45.09 140.95,44.95 U4.6 141.85,44.79 142.13,44.79 143,43.92 v143,43.28 | U4.4 140.17,44.45 140.81,45.09 | v141.5,39.78 141.6,39.68 C4_USB.2 | v12.5,64.78 10.84,63.12 U1.28 10.84,54.44 v11,54.28 | RESET_BUTTON.1 47.77,102.51 v48,102.28 | 51,102.78 51.27,103.05 RESET_BUTTON.2 | J4.G2 10.67,90.11 v11,89.78 | v15.5,90.28 16.37,91.15 J4.G1 | C_DELAY.2 53.23,86.05 v53.5,85.78 | v65,86.28 65,89.67 IC2.3 | U6.5 152.04,8.32 v152.5,8.78 | v160,16.28 160.34,16.62 J3.1 | D8.1 13.45,70 v13.23,69.78 | v13,52.78 14,52.78 14.5,53.28 15.29,53.28 U1.29_3 | U1.1 11.46,44.15 11.46,43.94 13,42.39 v13,41.78 | 51,102.78 53,100.78 v57,100.78 | v59,102.78 60.4,104.18 C10.2 | v13.67,40.45 13.67,40.11 15.45,38.33 D10.1 13.49,38.27 13,37.78 13,35.28 v13.5,34.78 | v18,34.78 19.45,36.23 D11.1 | C1_BAT1.2 107.15,37.63 v107.5,37.28 | v109.5,36.28 109.5,34.28 109,33.78 107.5,33.78 106.85,34.43 R1_PWRUSB.1 | J2.MP4 157.24,58.04 v157,58.28 | v161.5,60.78 162.5,59.78 162.5,58.22 J2.MP2 | v151.5,56.28 151.5,56.16 C5_USB.2 149.12,53.78 v151,53.78 | v153,57.28 154.49,58.77 R2-USB.2 | D1.5 149.65,50.28 v150.5,50.28 | v50.62,102.4 51,102.78
  Bottom 0.15: v72,38.28 75.5,38.28 v76.5,39.28 | v82,13.78 81.5,13.28 v80,13.28 | v143,43.28 141.5,41.78 v141.5,39.78 | v48,102.28 50.5,102.28 v50.62,102.4 | v11,89.78 15,89.78 v15.5,90.28 | v53.5,85.78 64.5,85.78 v65,86.28 | v152.5,8.78 v160,16.28 | v13.23,69.78 13.23,65.52 v12.5,64.78 | v11,54.28 12.5,52.78 v13,52.78 | v13,41.78 13.5,41.28 13.5,40.61 v13.67,40.45 | v57,100.78 v59,102.78 | v13.5,34.78 v18,34.78 | v107.5,37.28 108.5,37.28 v109.5,36.28 | v157,58.28 157,59.78 158.5,61.28 161,61.28 v161.5,60.78 | v151.5,56.28 152.5,57.28 v153,57.28 | v150.5,50.28 152,50.28 152.5,50.78 152.5,52.78 151.5,53.78 v151,53.78
  pour Top (hatched): 74.96,10.34 74.98,10.36 96.02,10.36 96.04,10.34 96.06,10.32 96.08,10.3 96.08,0.36 167.92,0.36 167.92,14.3 167.94,14.32 167.96,14.34 167.98,14.36 170.92,14.36 170.92,21.2 167.98,21.2 167.96,21.22 167.94,21.24 167.92,21.26 167.92,48.3 167.94,48.32 167.96,48.34 167.98,48.36 170.92,48.36 170.92,57.2 167.98,57.2 167.96,57.22 167.94,57.24 167.92,57.26 167.92,63.7 90.98,63.7 90.96,63.72 90.94,63.74 90.92,63.76 90.92,107.2 71.08,107.2 71.08,106.76 71.06,106.74 71.04,106.72 71.02,106.7 14.98,106.7 14.96,106.72 14.94,106.74 14.92,106.76 14.92,107.2 3.08,107.2 3.08,93.26 3.06,93.24 3.04,93.22 3.02,93.2 1.08,93.2 1.08,83.36 3.02,83.36 3.04,83.34 3.06,83.32 3.08,83.3 3.08,64.86 10.52,64.86 10.54,64.84 10.56,64.82 10.58,64.8 10.58,41.76 10.56,41.74 10.54,41.72 10.52,41.7 3.08,41.7 3.08,0.36 74.92,0.36 74.92,10.3 74.94,10.32
  pour Bottom (hatched): 74.96,10.34 74.98,10.36 96.02,10.36 96.04,10.34 96.06,10.32 96.08,10.3 96.08,0.36 167.92,0.36 167.92,14.3 167.94,14.32 167.96,14.34 167.98,14.36 170.92,14.36 170.92,21.2 167.98,21.2 167.96,21.22 167.94,21.24 167.92,21.26 167.92,48.3 167.94,48.32 167.96,48.34 167.98,48.36 170.92,48.36 170.92,57.2 167.98,57.2 167.96,57.22 167.94,57.24 167.92,57.26 167.92,63.7 90.98,63.7 90.96,63.72 90.94,63.74 90.92,63.76 90.92,107.2 71.08,107.2 71.08,106.76 71.06,106.74 71.04,106.72 71.02,106.7 14.98,106.7 14.96,106.72 14.94,106.74 14.92,106.76 14.92,107.2 3.08,107.2 3.08,93.26 3.06,93.24 3.04,93.22 3.02,93.2 1.08,93.2 1.08,83.36 3.02,83.36 3.04,83.34 3.06,83.32 3.08,83.3 3.08,64.86 10.52,64.86 10.54,64.84 10.56,64.82 10.58,64.8 10.58,41.76 10.56,41.74 10.54,41.72 10.52,41.7 3.08,41.7 3.08,0.36 74.92,0.36 74.92,10.3 74.94,10.32
GPIO8
  Top 0.15: R1.1 22.22,38.37 22.22,44.74 U1.10
I2C_PW  (via drill 0.3)
  Top 0.15: C2.1 146.87,4.85 146.87,6.24 C1.1 146.87,6.37 147.01,6.51 147.01,7.34 147.98,8.31 148.26,8.31 U6.8 148.39,8.45 148.39,9.14 149.09,9.84 | 149.09,9.84 149.09,11.22 U6.2 149.09,11.36 149.09,17.87 v153.09,21.88 | 149.09,9.84 149.92,9.01 149.92,8.45 U6.6 | 155.18,23.69 154.9,23.41 154.9,22.86 R1_PINH.2 | 155.18,23.69 157.54,23.69 158.37,22.86 158.78,22.86 R2_PINH.2 | v24.99,63.44 24.85,63.3 24.85,62.33 U1.17 | 155.18,23.69 v155.04,23.83
  Bottom 0.15: v24.99,63.44 25.96,64.41 91.06,64.41 91.19,64.27 91.19,64.13 91.33,63.99 125.82,63.99 155.04,34.77 v155.04,23.83 v153.09,21.88
INT_RTC
  Top 0.15: R1_PINH1.1 102.27,50.42 102.27,49.31 102.41,49.17 102.41,48.89 102,48.48 102,47.92 TP15.TP 101.86,47.79 97.7,47.79 95.76,49.72 | 95.76,49.72 95.63,49.59 88.7,49.59 79.35,58.94 33.1,58.94 19.87,45.71 19.87,44.88 U1.8 | 95.76,49.72 95.76,50.97 U3.3
IO/BOOT
  Top 0.15: R_BOOT.1 27.48,105.26 26.65,105.26 26.38,105.54 BOOT_BUTTON.3 26.24,105.68 22.77,105.68 BOOT_BUTTON.4 22.64,105.54 22.5,105.4 20.7,105.4 | 20.7,105.4 20.42,105.4 C6.1 20.7,105.4 | 20.7,105.4 19.17,106.92 15.3,106.92 15.16,107.06 15.16,107.34 15.02,107.48 2.97,107.48 2.83,107.34 2.83,94.74 2.14,94.04 1.58,94.04 0.75,93.21 0.75,83.38 1.03,83.1 2,83.1 2.28,82.83 2.28,75.29 11.38,66.19 21.54,66.19 22.95,64.78 25.78,64.78 27.35,63.21 27.35,62.33 U1.15
IO/CHANGE  (via drill 0.3)
  Top 0.15: R_CHANGE.1 68.06,105.4 66.54,105.4 66.4,105.54 CHANGE_BUTTON.3 66.26,105.68 62.8,105.68 CHANGE_BUTTON.4 62.66,105.54 61.28,105.54 C10.1 61.14,105.54 60.72,105.54 v60.31,105.12 | v19.17,63.99 18.2,63.99 17.23,63.02 17.23,62.33 U1.23
  Bottom 0.15: v60.31,105.12 v19.17,63.99
MISO  (via drill 0.3)
  Top 0.15: U5.2 50.34,56.51 47.7,56.51 47.34,56.87 46.96,56.87 46.7,56.61 46.7,53.56 38.7,45.57 38.7,40.03 38.56,39.89 D12.2 38.42,39.75 v37.59,39.75 | J4.P7 7.96,81.58 7.96,75.62 5.9,73.57 5.9,72.25 8.35,69.81 v11.83,69.81 12.83,68.81 14.3,68.81 15.99,70.5 17.37,70.5 18.34,71.47 TP6.TP | v11.83,63.44 11.83,62.47 11.97,62.33 U1.27 11.97,62.19 11.97,53.72 10.03,51.78 10.03,43.63 12.59,41.08 13.88,41.08 16.97,37.99 16.97,37.27 16.8,37.1 16.8,32.41 17.07,32.13 17.93,32.13 19.04,33.24 19.87,33.24 R8.1 21.16,33.15 v21.32,33.31
  Bottom 0.15: v11.83,63.44 v11.83,69.81 | v37.59,39.75 27.84,39.75 23.89,35.8 23.81,35.8 v21.32,33.31
MOSI  (via drill 0.3)
  Top 0.15: R7.1 17.51,32.97 17.51,36.98 19.04,38.51 19.31,38.51 D11.2 19.31,38.64 19.31,39.2 v19.04,39.48 | 10.59,71.61 10.45,71.47 9.06,71.47 7.82,72.72 7.12,72.72 TP7.TP | 10.59,71.61 12.39,73.41 12.39,81.58 J4.P3 | v11.83,70.5 10.73,71.61 10.59,71.61 | J1.14 84.82,15.51 84.82,16.98 72.77,29.03 72.77,39.61 59.06,53.33 58.65,53.33 58.51,53.46 58.51,53.88 58.37,54.02 58.23,54.02 U5.5 58.09,54.02 57.54,54.02 v48.81,45.29 | U1.7 18.48,44.75 18.48,40.63 v18.51,40.61
  Bottom 0.15: 18.48,42.66 18.48,40.58 | 18.48,42.66 11,50.14 10.59,50.14 10.31,50.42 10.31,68.98 v11.83,70.5 | 18.48,40.58 v18.51,40.61 | v19.04,39.48 18.7,39.81 18.7,40.2 18.48,40.42 18.48,40.58 | v48.81,45.29 46.26,42.74 29.83,42.74 29.76,42.66 18.48,42.66
N$1  (via drill 0.3)
  Top 0.15: v78.87,24.38 78.59,24.66 78.59,25.07 EPD_C12.2 | v79.83,20.77 79.83,15.53 J1.24
  Bottom 0.15: v78.87,24.38 79.83,23.42 v79.83,20.77
N$2
  Top 0.15: R1_BAT.2 125.4,45.85 125.4,48.2 U2.1
N$3
  Top 0.15: CHG_LED.C 124.16,44.18 124.16,45.71 R1_BAT.1
N$4
  Top 0.15: R_CAPACITOR.1 93.83,53.6 93.83,54.43 94.52,55.13 94.52,55.68 D7.1
N$5
  Top 0.15: R2-USB1.2 162.94,42.66 162.38,42.66 160.31,44.74 160.31,50.42 159.06,51.66 158.23,51.66 J2.A5
N$6
  Top 0.15: R2-USB.1 154.63,57.62 156.7,57.62 157.67,56.65 159.61,56.65 160.17,56.1 160.17,55.54 159.34,54.71 158.23,54.71 J2.B5
N$7
  Top 0.15: R2_BAT.2 120.14,51.25 120.14,50.28 122.22,48.2 122.77,48.2 U2.5
N$8  (via drill 0.3)
  Top 0.15: v89.81,19.12 89.81,15.51 J1.4 | v91.47,24.8 91.89,25.21 91.89,25.63 EPD_C1.2
  Bottom 0.15: v89.81,19.12 89.81,23.13 v91.47,24.8
N$9
  Top 0.15: C1_BAT1.1 106.57,38.92 108.23,38.92 108.92,39.61 110.31,39.61 111.14,38.78 111.55,38.78 D2.1 111.69,38.64 111.69,37.4 116.68,32.41 116.68,32.13 IC4.1 116.68,32 117.37,32 117.65,31.72 | 117.65,31.72 117.65,30.61 117.23,30.2 116.68,30.2 IC4.3 | 117.65,31.72 123.33,37.4 128.17,37.4 Q1.2
N$10  (via drill 0.3)
  Top 0.15: v89.25,18.56 89.25,15.51 J1.5 | v89.81,26.32 89.67,26.46 89.67,26.6 89.95,26.87 90.36,26.87 EPD_C2.2
  Bottom 0.15: v89.25,18.56 89.25,25.76 v89.81,26.32
N$11  (via drill 0.3)
  Top 0.15: v69.45,40.03 69.17,40.31 69.17,40.45 68.89,40.72 C4.1 | v78.87,43.22 79.14,43.49 79.7,43.49 D3.2 79.84,43.49 79.97,43.35 85.24,43.35 91.89,36.7 95.63,36.7 D4.1
  Bottom 0.15: v69.45,40.03 75.68,40.03 v78.87,43.22
N$12  (via drill 0.3)
  Top 0.15: v86.35,24.8 86.9,25.35 86.9,25.63 EPD_C6.2 | J1.18 82.75,15.51 82.75,15.93 82.88,16.07 82.88,16.21 82.75,16.35 82.75,17.59 v82.87,17.72
  Bottom 0.15: v82.87,17.72 86.35,21.19 v86.35,24.8
N$13  (via drill 0.3)
  Top 0.15: v85.52,24.8 85.93,25.21 85.93,25.63 EPD_C7.2 | v82.32,18.28 82.32,15.52 J1.19
  Bottom 0.15: v85.52,24.8 85.52,21.47 v82.32,18.28
N$14  (via drill 0.3)
  Top 0.15: v83.99,24.8 84.41,25.21 84.41,25.63 EPD_C8.2 | J1.20 81.78,15.51 81.78,18.56 v81.91,18.69
  Bottom 0.15: v83.99,24.8 81.92,22.72 81.92,18.7 v81.91,18.69
N$15  (via drill 0.3)
  Top 0.15: v55.6,87.4 51.86,87.4 C_DELAY.1 | IC2.5 67.93,91.69 67.39,91.69 v67.11,91.4
  Bottom 0.15: v55.6,87.4 63.08,87.4 67.08,91.4 v67.11,91.4
N$16  (via drill 0.3)
  Top 0.15: v81.08,24.8 81.5,25.21 81.5,25.63 EPD_C10.2 | v80.8,19.8 J1.22
  Bottom 0.15: v81.08,24.8 81.08,20.09 v80.8,19.8
PREVGH  (via drill 0.3)
  Top 0.15: v82.61,24.8 83.02,25.21 83.02,25.63 EPD_C9.2 | D5.1 90.5,36.43 90.5,32.69 v87.05,29.24 | v81.35,19.25 81.35,15.55 J1.21
  Bottom 0.15: v81.35,19.25 81.36,19.25 81.36,23.55 v82.61,24.8 v87.05,29.24
PREVGL  (via drill 0.3)
  Top 0.15: J1.23 80.25,15.51 80.25,20.09 v80.38,20.21 | EPD_C11.2 79.97,25.21 79.97,24.93 v80.39,24.52 80.67,24.24 92.03,24.24 93,25.21 93,26.46 99.23,32.69 99.23,36.57 D4.2
  Bottom 0.15: v80.39,24.52 80.39,20.22 v80.38,20.21
RESE
  Top 0.15: J1.3 90.36,15.38 90.36,14.82 88.8,13.26 81.06,13.26 66.61,27.7 65.71,27.7 R3.2 65.71,27.84 65.71,28.26 64.88,29.09 61.42,29.09 Q3.2
RESE'
  Top 0.15: SJ1.2 55.88,15.51 55.6,15.79 55.6,17.04 R2.2 55.74,17.18 55.74,23.13 60.45,27.84 60.45,28.12 60.72,28.4 62.11,28.4 62.66,27.84 64.33,27.84 R3.1
RESET
  Top 0.15: C5.1 46.46,105.12 47.29,105.12 47.7,105.54 RESET_BUTTON.4 47.84,105.68 49.09,105.68 49.92,104.85 | R_RESET.1 52.69,105.12 51.72,105.12 51.31,105.54 RESET_BUTTON.3 51.17,105.54 50.61,105.54 49.92,104.85 | 60.64,91.74 49.92,102.46 49.92,104.85 | IC2.1 65.16,91.83 60.72,91.83 60.64,91.74 | 60.64,91.74 18.62,49.72 17.51,49.72 13.49,45.71 13.49,44.88 U1.3
RTC_RST  (via drill 0.3)
  Top 0.15: v26.52,63.44 26.1,63.02 26.1,62.33 U1.16 | v79.28,59.42 86.21,52.5 94.38,52.5 94.52,52.36 94.52,51.11 U3.4
  Bottom 0.15: v26.52,63.44 30.12,63.44 31.84,61.71 76.99,61.71 v79.28,59.42
RX  (via drill 0.3)
  Top 0.15: v15.99,63.99 15.99,62.33 U1.24 | v18.48,66.62 19.04,67.17 19.04,67.73 TP2.TP
  Bottom 0.15: v15.99,63.99 18.48,66.48 v18.48,66.62
SCK  (via drill 0.3)
  Top 0.15: J4.P5 10.17,81.58 10.17,74.38 v10.31,74.24 10.31,73.96 9.89,73.55 9.89,72.99 TP8.TP | R6.1 15.43,33.11 15.43,36.7 D10.2 15.57,36.84 15.85,36.84 v16.54,37.54 | v17.23,40.58 16.73,41.08 16.73,44.31 U1.6 17.19,45.48 v16.68,45.98 | U5.6 73.05,40.45 73.05,29.15 85.24,16.96 85.24,15.51 J1.13 | v48.81,45.98 49.09,45.98 57.26,54.16 57.26,54.3 U5.6 | U5.6
  Bottom 0.15: v17.23,40.58 17.23,38.23 v16.54,37.54 | v10.31,74.24 10.86,74.24 13.69,71.42 13.69,48.98 v16.68,45.98 v48.81,45.98
SCL  (via drill 0.3)
  Top 0.15: 162.11,19.67 162.8,19.67 163.21,19.25 163.21,16.07 158.37,11.22 150.75,11.22 U6.4 | U4.7 141.75,45.43 v142.44,45.43 142.99,45.43 147.84,40.58 147.84,35.6 160.17,23.27 160.17,22.86 R2_PINH.1 160.03,22.72 160.03,22.3 162.11,20.22 162.11,19.67 | 162.11,19.67 J3.4 | v26.1,63.85 25.96,63.99 21.94,63.99 21.11,63.16 21.11,62.33 U1.20 | v98.12,43.22 98.53,42.8 98.53,41.97 98.4,41.83 U3.16
  Bottom 0.15: v26.1,63.85 26.24,63.85 26.38,63.99 77.34,63.99 v98.12,43.22 100.33,45.43 v142.44,45.43
SDA  (via drill 0.3)
  Top 0.15: U6.3 149.92,11.36 149.92,12.05 153.52,15.65 162.38,15.65 162.94,16.21 162.94,18.29 162.66,18.56 162.11,18.56 J3.3 161.97,18.7 159.34,18.7 156.01,22.02 | v140.36,42.66 145.35,42.66 147.56,40.45 147.56,28.67 154.35,21.89 155.87,21.89 156.01,22.02 | 156.01,22.02 156.01,22.72 R1_PINH.1 | U4.8 141.61,45.98 141.61,46.26 141.58,46.29 139.27,46.29 138.71,45.72 138.71,44.07 139.09,43.69 139.14,43.69 140.17,42.66 v140.36,42.66 | v96.87,43.22 97.01,43.08 97.01,41.83 U3.15 | U1.19 22.36,62.19 22.36,61.36 22.99,60.73 28.93,60.73 v31.22,63.02 | v140.36,42.66 v140.37,42.67
  Bottom 0.15: v31.22,63.02 77.07,63.02 v96.87,43.22 98.26,41.83 133.44,41.83 134.27,42.66 v140.36,42.66 v140.37,42.67
SRC  (via drill 0.3)
  Top 0.15: D5.2 86.9,36.43 83.85,36.43 82.33,34.91 81.64,34.91 L1.P$2 81.5,34.77 79.42,34.77 v73.61,40.58 | Q3.3 59.06,28.53 57.95,28.53 54.91,31.58 54.91,32.55 64.05,41.69 69.86,41.69 70.14,41.41 70.14,40.86 C4.2 70.28,40.72 70.42,40.58 v70.97,40.58
  Bottom 0.15: v70.97,40.58 v73.61,40.58
SS_SD  (via drill 0.3)
  Top 0.15: R10.1 13.63,96.81 13.63,94.04 14.88,92.8 14.88,84.35 13.36,82.83 13.36,82.13 J4.P2 13.49,82 13.49,72.44 D8.2 13.36,72.3 12.94,72.3 v12.53,71.89 | v14.46,45.98 14.6,45.85 14.6,44.88 U1.4
  Bottom 0.15: v14.46,45.98 11.14,49.31 11.14,49.45 10.73,49.86 10.45,49.86 10.03,50.28 10.03,69.39 v12.53,71.89
TX  (via drill 0.3)
  Top 0.15: v14.74,63.99 14.74,62.33 U1.25 | v15.85,67.59 15.99,67.73 15.99,67.87 16.4,68.28 16.4,68.84 TP1.TP
  Bottom 0.15: v14.74,63.99 14.74,66.48 v15.85,67.59
USB_D+  (via drill 0.3)
  Top 0.15: D1.4 149.23,49.59 148.39,49.59 143.97,45.17 v143.96,45.17 | U1.14 27.48,44.88 35.37,36.99 v58.24,36.99
  Bottom 0.15: v143.96,45.17 142.81,44.01 142.7,44.01 134.48,35.79 59.44,35.79 v58.24,36.99
USB_D-  (via drill 0.3)
  Top 0.15: v144.38,44.74 147.9,44.74 151.47,48.31 151.47,50.75 150.69,51.52 149.36,51.52 D1.6 | v29.29,40.86 26.1,44.05 26.1,44.74 U1.13
  Bottom 0.15: v29.29,40.86 50.75,40.86 56.43,35.18 134.26,35.18 142.81,43.73 142.92,43.73 143.93,44.74 v144.38,44.74
VBAT  (via drill 0.3)
  Top 0.3: 125.96,50.56 125.96,51.94 127.34,53.33 127.9,53.33 C2_BAT.1 | 125.96,50.56 125.54,50.14 U2.3 | U4.2 139.81,45.43 139.81,45.02 U4.3 139.67,44.88 139.25,44.88 139.06,44.68 139.06,44.22 139.24,44.04 139.29,44.04 139.56,43.77 v139.81,43.77 | Q1.3 130.39,38.37 130.39,39.48 131.5,40.58 131.5,40.72 131.91,41.14 131.91,41.69 TP3.TP | v133.3,42.38 133.16,42.25 133.02,42.25 132.61,41.83 132.05,41.83 TP3.TP | 125.96,50.56 131.91,44.6 131.91,41.83 TP3.TP
  Bottom 0.3: v139.81,43.77 134.68,43.77 v133.3,42.38
VBUS
  Top 0.3: C5_USB.1 147.84,53.74 147.84,50.97 147.43,50.56 146.87,50.56 D1.2 146.73,50.69 142.72,50.69 138.35,46.33 138.35,43.93 138.95,43.33 139,43.33 141.61,40.72 | PFMF.050.1.2 144.38,40.45 143.82,41 142.58,41 C4_USB.1 142.44,41 141.88,41 141.61,40.72 | 141.61,40.72 137.45,36.57 137.45,36.01 TP14.TP 137.31,35.87 131.22,35.87 128.31,38.78 128.31,39.2 Q1.1 128.17,39.34 126.79,39.34 122.5,43.63 122.5,44.05 CHG_LED.A 122.5,44.18 122.5,44.74 121.8,45.43 | 108.09,36.2 108.09,36.84 109.48,38.23 109.48,38.64 D2.2 | 108.09,36.2 108.09,35.32 R1_PWRUSB.2 | 121.8,45.43 120,47.23 119.72,47.23 C1_BAT.1 119.59,47.09 119.59,46.68 119.03,46.12 112.35,46.12 105.74,39.51 105.74,36.2 108.09,36.2 | 121.8,45.43 124.02,47.65 124.02,48.62 122.91,49.72 U2.4
VRTC  (via drill 0.3)
  Top 0.3: v95.49,52.5 95.21,52.77 95.21,53.46 R_CAPACITOR.2 | v95.49,46.54 95.49,43.35 95.76,43.08 95.76,41.83 U3.14 95.76,41.69 95.76,40.58 97.84,38.51 102.41,38.51 C8.1 102.55,38.51 102.83,38.78 102.83,43.63 105.32,46.12 105.74,46.12 C10_SUPERCAP.1
  Bottom 0.3: v95.49,46.54 v95.49,52.5
VUSB
  Top 0.3: J2.A4 158.23,50.42 158.23,50.56 J2.B9 158.09,50.69 157.26,50.69 | J2.B4 158.23,55.26 158.23,55.4 J2.A9 158.09,55.4 157.54,55.4 156.84,54.71 156.84,51.11 157.26,50.69 | 157.26,50.69 149.64,43.08 149.64,41 149.09,40.45 PFMF.050.1.1
(copper drawn outside any net)
  shapes: Top area x8